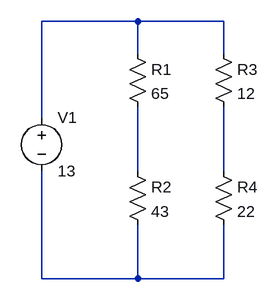
[diagram p0: schematic 2ser2par.asc]
2ser2par.asc, the LTspice schematic file:
Version 4
SHEET 1 880 680
WIRE 256 0 112 0
WIRE 384 0 256 0
WIRE 256 48 256 0
WIRE 384 48 384 0
WIRE 112 144 112 0
WIRE 256 224 256 128
WIRE 384 224 384 128
WIRE 112 384 112 224
WIRE 256 384 256 304
WIRE 256 384 112 384
WIRE 384 384 384 304
WIRE 384 384 256 384
SYMBOL voltage 112 128 R0
WINDOW 123 0 0 Left 0
WINDOW 39 0 0 Left 0
SYMATTR InstName V1
SYMATTR Value 13
SYMBOL res 240 32 R0
SYMATTR InstName R1
SYMATTR Value 65
SYMBOL res 240 208 R0
SYMATTR InstName R2
SYMATTR Value 43
SYMBOL res 368 32 R0
SYMATTR InstName R3
SYMATTR Value 12
SYMBOL res 368 208 R0
SYMATTR InstName R4
SYMATTR Value 22

The netlist it stands for:
* 2ser2par.asc
V1 N001 N004 13
R1 N001 N002 65
R2 N002 N004 43
R3 N001 N003 12
R4 N003 N004 22
.backanno
.end